# EAGLE schematic qsd67lc (EAGLE 9.2.1)

## Sheet 1 of 8: Supply
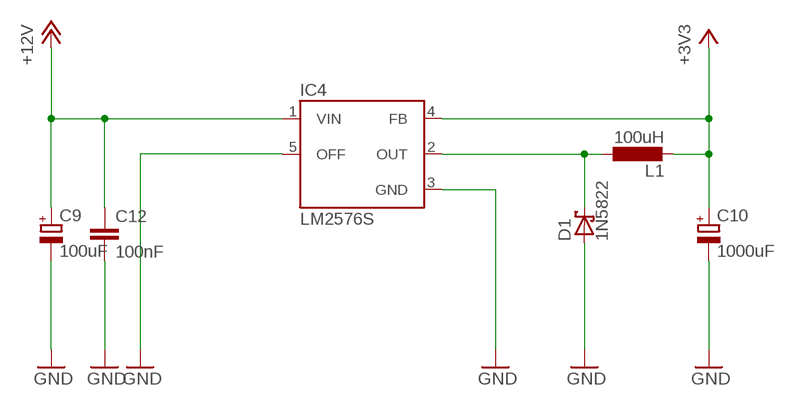
[diagram p0: schematic, sheet 1]

### Parts
C9  100uF  CPOL-EUE5-13  [E5-13]
C10  1000uF  CPOL-EUE5-10.5  [E5-10,5]
C12  100nF  C-EUC0805  [C0805]
D1  1N5822  SCHOTTKY-DIODEDO201T15  [DO201T15]
IC4  LM2576S  [TO263-5]
L1  100uH  L-EU2200-15.24  [2200-15.24]

### Nets
+3V3: C10.+ IC4.4(FB) L1.2 ; also sheet 2,3,5,6
+12V: C9.+ C12.1 IC4.1(VIN) ; also sheet 2,4,7
GND: C9.- C10.- C12.2 D1.A IC4.3(GND) IC4.5(OFF) ; also sheet 2,3,4,5,6,7
N$22: D1.C IC4.2(OUT) L1.1

## Sheet 2 of 8: atmega8
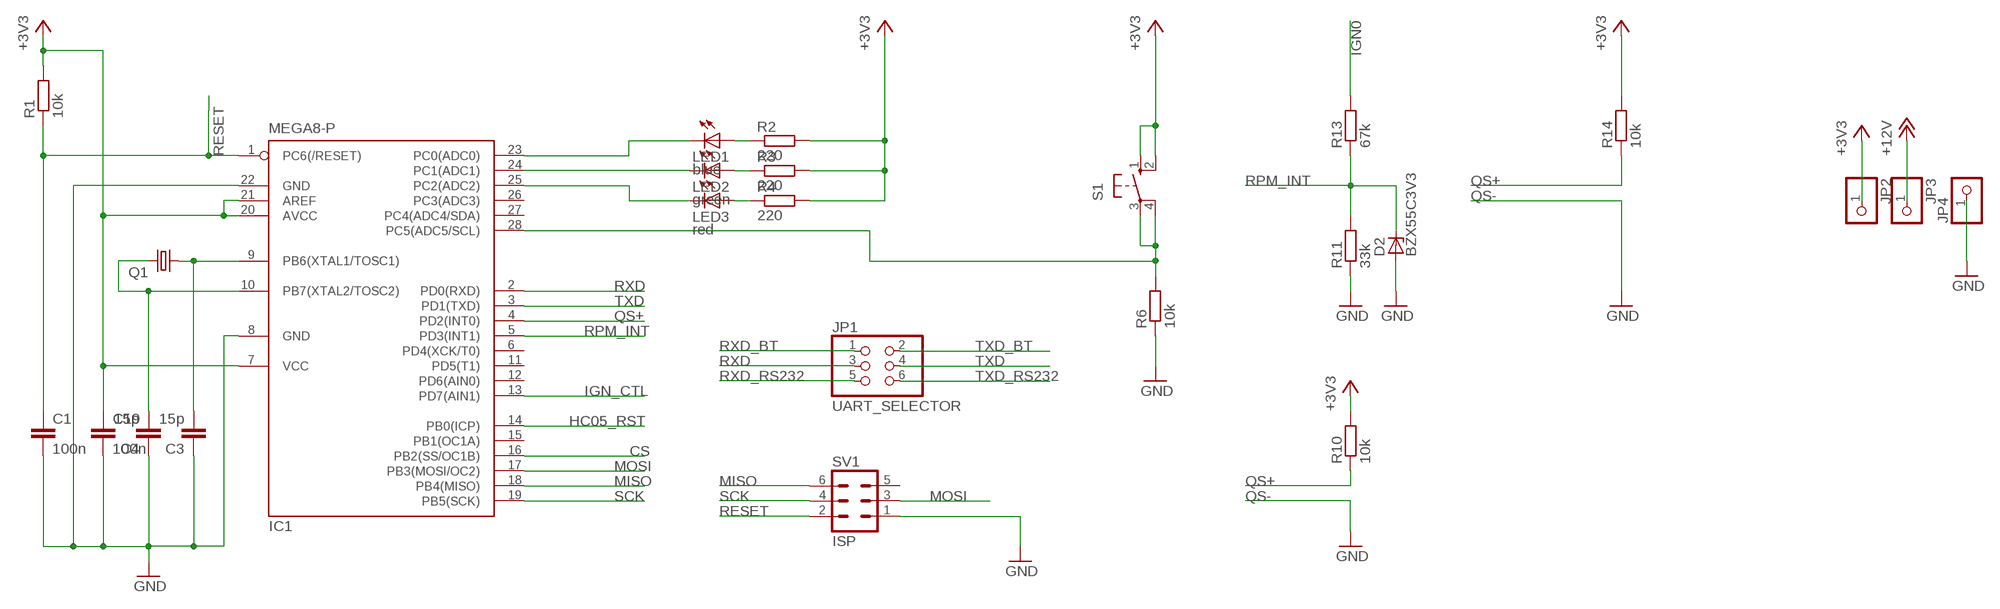
[diagram p1: schematic, sheet 2]

### Parts
C1  100n  C-EUC0805  [C0805]
C3  15p  C-EUC0805  [C0805]
C4  15p  C-EUC0805  [C0805]
C19  100n  C-EUC0805  [C0805]
D2  BZX55C3V3  BZX55  [DO35Z10]
IC1  MEGA8-P  [DIL28-3]
JP1  UART_SELECTOR  PINHD-2X3  [2X03]
JP2  PINHD-1X1  [1X01]
JP3  PINHD-1X1  [1X01]
JP4  PINHD-1X1  [1X01]
LED1  blue  LEDCHIP-LED0805  [CHIP-LED0805]
LED2  green  LEDCHIP-LED0805  [CHIP-LED0805]
LED3  red  LEDCHIP-LED0805  [CHIP-LED0805]
Q1  CRYSTALHC18U-V  [HC18U-V]
R1  10k  R-EU_R0805  [R0805]
R2  220  R-EU_R0805  [R0805]
R3  220  R-EU_R0805  [R0805]
R4  220  R-EU_R0805  [R0805]
R6  10k  R-EU_R0805  [R0805]
R10  10k  R-EU_R0805  [R0805]
R11  33k  R-EU_R0805  [R0805]
R13  67k  R-EU_R0805  [R0805]
R14  10k  R-EU_R0805  [R0805]
S1  10-XX  [B3F-10XX]
SV1  ISP  ML6  [ML6]

### Nets
+3V3: C19.1 IC1.7(VCC) IC1.20(AVCC) IC1.21(AREF) JP2.1 R1.2 R2.2 R3.2 R4.2 R10.2 R14.2 S1.1(S) S1.2(S1) ; also sheet 1,3,5,6
+12V: JP3.1 ; also sheet 1,4,7
CS: IC1.16(PB2(SS/OC1B))
GND: C1.2 C3.1 C4.1 C19.2 D2.A IC1.8(GND) IC1.22(GND) JP4.1 R6.1 R11.1 SV1.1 ; also sheet 1,3,4,5,6,7
HC05_RST: IC1.14(PB0(ICP)) ; also sheet 3
IGN0: R13.2 ; also sheet 7
IGN_CTL: IC1.13(PD7(AIN1)) ; also sheet 4
MISO: IC1.18(PB4(MISO)) SV1.6
MOSI: IC1.17(PB3(MOSI/OC2)) SV1.3
N$1: IC1.24(PC1(ADC1)) LED2.C
N$2: C3.2 IC1.9(PB6(XTAL1/TOSC1)) Q1.1
N$3: C4.2 IC1.10(PB7(XTAL2/TOSC2)) Q1.2
N$4: LED2.A R3.1
N$5: LED1.A R2.1
N$6: LED3.A R4.1
N$7: IC1.23(PC0(ADC0)) LED1.C
N$9: IC1.25(PC2(ADC2)) LED3.C
N$12: IC1.28(PC5(ADC5/SCL)) R6.2 S1.3(P) S1.4(P1)
QS+: IC1.4(PD2(INT0)) R10.1 R14.1 ; also sheet 7
RESET: C1.1 IC1.1(PC6(/RESET)) R1.1 SV1.2
RPM_INT: D2.C IC1.5(PD3(INT1)) R11.2 R13.1
RXD: IC1.2(PD0(RXD)) JP1.3
RXD_BT: JP1.1 ; also sheet 3
RXD_RS232: JP1.5 ; also sheet 5,6
SCK: IC1.19(PB5(SCK)) SV1.4
TXD: IC1.3(PD1(TXD)) JP1.4
TXD_BT: JP1.2 ; also sheet 3
TXD_RS232: JP1.6 ; also sheet 5,6
Unconnected: IC1.6(PD4(XCK/T0)) IC1.11(PD5(T1)) IC1.12(PD6(AIN0)) IC1.15(PB1(OC1A)) IC1.26(PC3(ADC3)) IC1.27(PC4(ADC4/SDA)) SV1.5

## Sheet 3 of 8: bluetooth
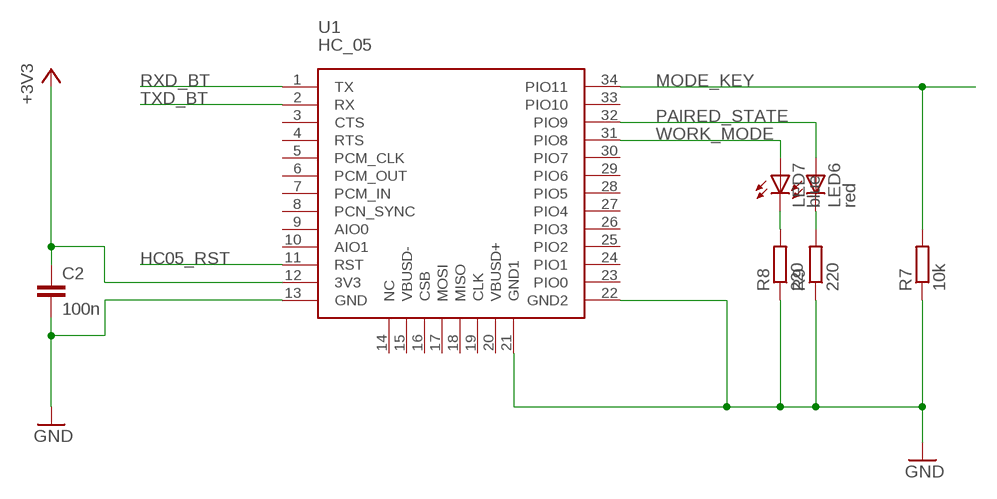
[diagram p2: schematic, sheet 3]

### Parts
C2  100n  C-EUC0805  [C0805]
LED6  red  LEDCHIP-LED0805  [CHIP-LED0805]
LED7  blue  LEDCHIP-LED0805  [CHIP-LED0805]
R7  10k  R-EU_R0805  [R0805]
R8  220  R-EU_R0805  [R0805]
R9  220  R-EU_R0805  [R0805]
U1  HC_05  [BLUETOOTH_SMD]

### Nets
+3V3: C2.1 U1.12(3V3) ; also sheet 1,2,5,6
GND: C2.2 R7.1 R8.1 R9.1 U1.13(GND) U1.21(GND1) U1.22(GND2) ; also sheet 1,2,4,5,6,7
HC05_RST: U1.11(RST) ; also sheet 2
MODE_KEY: R7.2 U1.34(PIO11)
N$13: LED7.C R8.2
N$14: LED6.C R9.2
PAIRED_STATE: LED6.A U1.32(PIO9)
RXD_BT: U1.1(TX) ; also sheet 2
TXD_BT: U1.2(RX) ; also sheet 2
WORK_MODE: LED7.A U1.31(PIO8)
Unconnected: U1.3(CTS) U1.4(RTS) U1.5(PCM_CLK) U1.6(PCM_OUT) U1.7(PCM_IN) U1.8(PCN_SYNC) U1.9(AIO0) U1.10(AIO1) U1.14(NC) U1.15(VBUSD-) U1.16(CSB) U1.17(MOSI) U1.18(MISO) U1.19(CLK) U1.20(VBUSD+) U1.23(PIO0) U1.24(PIO1) U1.25(PIO2) U1.26(PIO3) U1.27(PIO4) U1.28(PIO5) U1.29(PIO6) U1.30(PIO7) U1.33(PIO10)

## Sheet 4 of 8: ignition
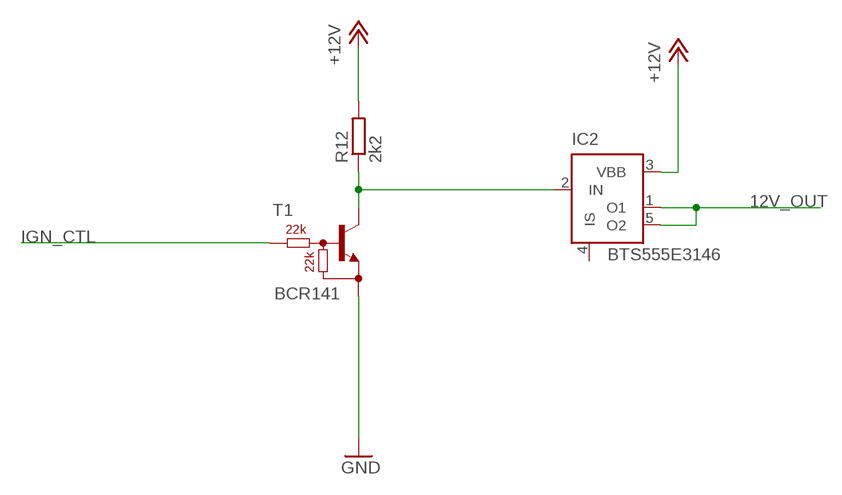
[diagram p3: schematic, sheet 4]

### Parts
IC2  BTS555E3146  [TO220-52]
R12  2k2  R-EU_R0805  [R0805]
T1  BCR141  [SOT23-R_INFINEON]

### Nets
12V_OUT: IC2.1(O1) IC2.5(O2) ; also sheet 7
+12V: IC2.3(VBB) R12.2 ; also sheet 1,2,7
GND: T1.2(E) ; also sheet 1,2,3,5,6,7
IGN_CTL: T1.1(B) ; also sheet 2
N$16: IC2.2(IN) R12.1 T1.3(C)
Unconnected: IC2.4(IS)

## Sheet 5 of 8: RS232
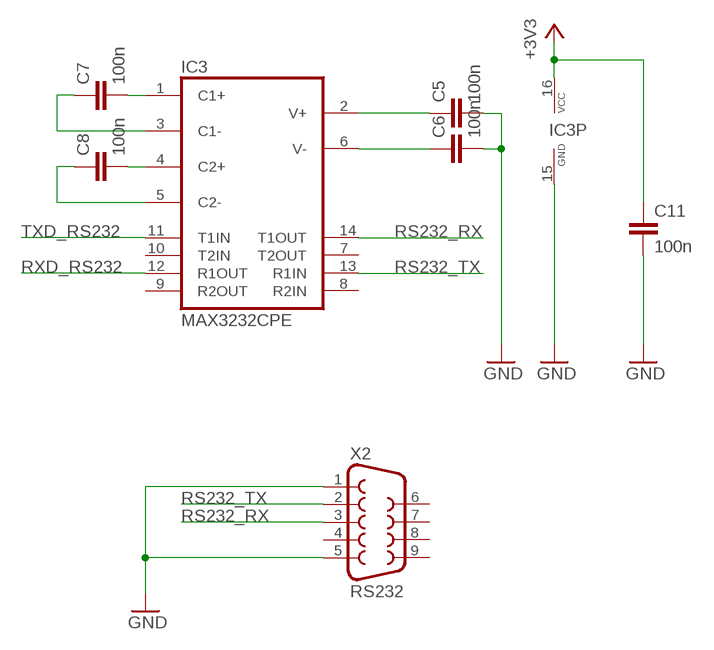
[diagram p4: schematic, sheet 5]

### Parts
C5  100n  C-EUC0805  [C0805]
C6  100n  C-EUC0805  [C0805]
C7  100n  C-EUC0805  [C0805]
C8  100n  C-EUC0805  [C0805]
C11  100n  C-EUC0805  [C0805]
IC3  MAX3232CPE  [DIL16]
X2  RS232  F09HP  [F09HP]

### Nets
+3V3: C11.1 IC3.16(VCC) ; also sheet 1,2,3,6
GND: C5.2 C6.2 C11.2 IC3.15(GND) X2.1 X2.5 ; also sheet 1,2,3,4,6,7
N$11: C5.1 IC3.2(V+)
N$15: C6.1 IC3.6(V-)
N$17: C7.2 IC3.1(C1+)
N$18: C8.2 IC3.4(C2+)
N$19: C8.1 IC3.5(C2-)
N$20: C7.1 IC3.3(C1-)
RS232_RX: IC3.14(T1OUT) X2.3
RS232_TX: IC3.13(R1IN) X2.2
RXD_RS232: IC3.12(R1OUT) ; also sheet 2,6
TXD_RS232: IC3.11(T1IN) ; also sheet 2,6
Unconnected: IC3.7(T2OUT) IC3.8(R2IN) IC3.9(R2OUT) IC3.10(T2IN) X2.4 X2.6 X2.7 X2.8 X2.9

## Sheet 6 of 8: USB FTDI
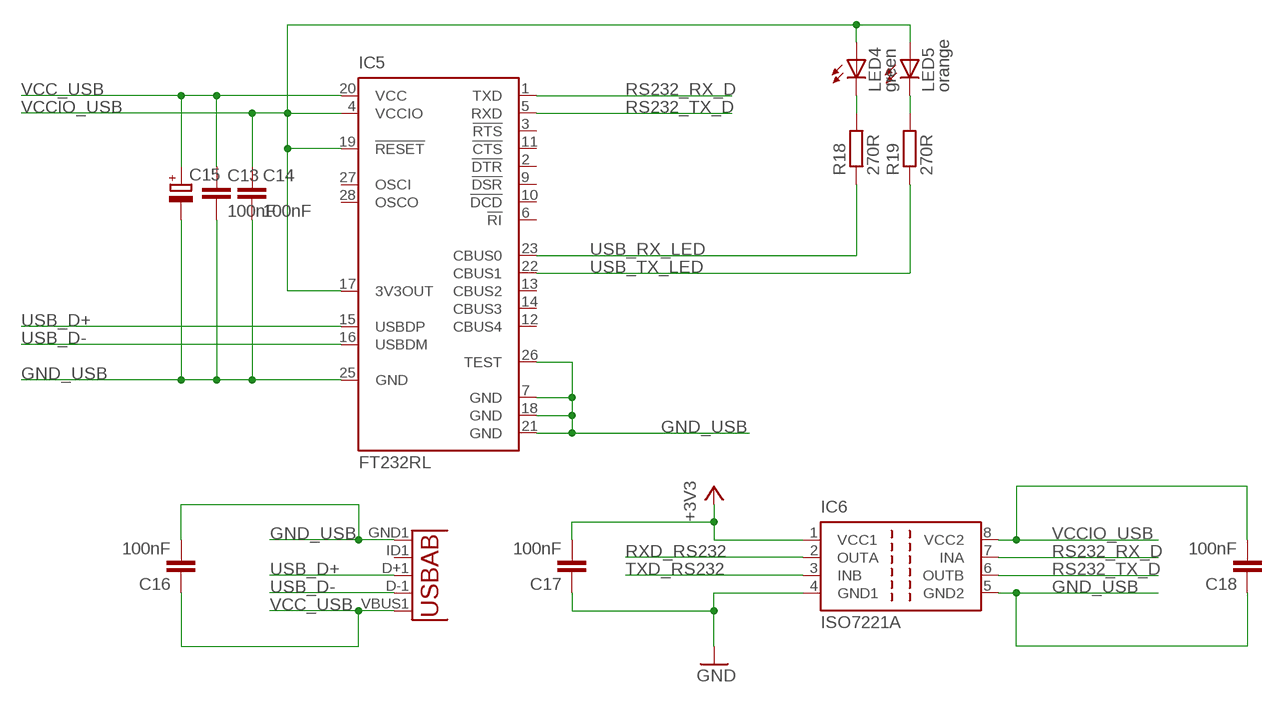
[diagram p5: schematic, sheet 6]

### Parts
C13  100nF  C-EUC0805  [C0805]
C14  100nF  C-EUC0805  [C0805]
C15  CPOL-EUE2.5-5  [E2,5-5]
C16  100nF  C-EUC0805  [C0805]
C17  100nF  C-EUC0805  [C0805]
C18  100nF  C-EUC0805  [C0805]
IC5  FT232RL  [SSOP28]
IC6  ISO7221A  [SO-08]
LED4  green  LEDSML0805  [SML0805]
LED5  orange  LEDSML0805  [SML0805]
R18  270R  R-EU_R0805  [R0805]
R19  270R  R-EU_R0805  [R0805]
U2  USB""  [USB-MICRO-SMD]

### Nets
+3V3: C17.2 IC6.1(VCC1) ; also sheet 1,2,3,5
GND: C17.1 IC6.4(GND1) ; also sheet 1,2,3,4,5,7
GND_USB: C13.2 C14.2 C15.- C16.2 C18.1 IC5.7(GND) IC5.18(GND) IC5.21(GND) IC5.25(GND) IC5.26(TEST) IC6.5(GND2) U2.GND1(GND)
N$23: LED4.C R18.2
N$26: LED5.C R19.2
RS232_RX_D: IC5.1(TXD) IC6.7(INA)
RS232_TX_D: IC5.5(RXD) IC6.6(OUTB)
RXD_RS232: IC6.2(OUTA) ; also sheet 2,5
TXD_RS232: IC6.3(INB) ; also sheet 2,5
USB_D+: IC5.15(USBDP) U2.D+1(D+)
USB_D-: IC5.16(USBDM) U2.D-1(D-)
USB_RX_LED: IC5.23(CBUS0) R18.1
USB_TX_LED: IC5.22(CBUS1) R19.1
VCC_USB: C13.1 C15.+ C16.1 IC5.20(VCC) U2.VBUS1(VBUS)
VCCIO_USB: C14.1 C18.2 IC5.4(VCCIO) IC5.17(3V3OUT) IC5.19(!RESET) IC6.8(VCC2) LED4.A LED5.A
Unconnected: IC5.2(!DTR) IC5.3(!RTS) IC5.6(!RI) IC5.9(!DSR) IC5.10(!DCD) IC5.11(!CTS) IC5.12(CBUS4) IC5.13(CBUS2) IC5.14(CBUS3) IC5.27(OSCI) IC5.28(OSCO) U2.ID1(USBID)

## Sheet 7 of 8: Connectors
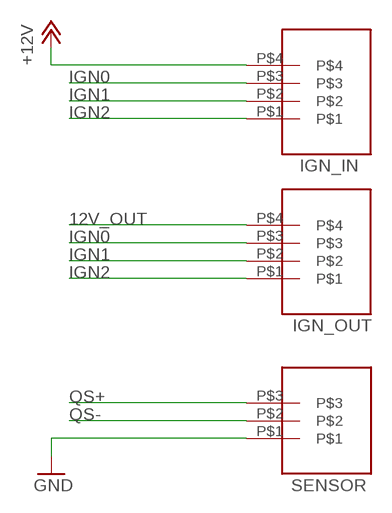
[diagram p6: schematic, sheet 7]

### Parts
CON1  RIA-AKL-230-04  [CON-RIA-P4]
CON2  RIA-AKL-230-04  [CON-RIA-P4]
CON3  RIA-AKL-230-03  [CON-RIA-P3]

### Nets
12V_OUT: CON2.P$4 ; also sheet 4
+12V: CON1.P$4 ; also sheet 1,2,4
GND: CON3.P$1 ; also sheet 1,2,3,4,5,6
IGN0: CON1.P$3 CON2.P$3 ; also sheet 2
IGN1: CON1.P$2 CON2.P$2
IGN2: CON1.P$1 CON2.P$1
QS+: CON3.P$3 ; also sheet 2
QS-: CON3.P$2 ; also sheet 2

### Notes on the sheet
- IGN_IN
- IGN_OUT
- SENSOR

## Sheet 8 of 8: holes
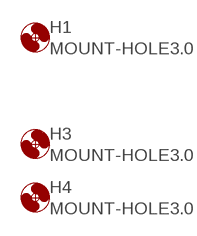
[diagram p7: schematic, sheet 8]

### Parts
H1  MOUNT-HOLE3.0  [3,0]
H3  MOUNT-HOLE3.0  [3,0]
H4  MOUNT-HOLE3.0  [3,0]

## Library data of the parts
C1-C8 C11-C14 C16-C19 = rcl:C-EU: CAPACITOR, European symbol; SPICEPREFIX: C
C9 C10 C15 = rcl:CPOL-EU: POLARIZED CAPACITOR, European symbol; SPICEPREFIX: C
CON1 CON2 = con-ria:RIA-AKL-230-04
CON3 = con-ria:RIA-AKL-230-03
D1 = diode:SCHOTTKY-DIODE: Schottky Diode
D2 = diode:BZX55: Z DIODE
H1 H3 H4 = holes:MOUNT-HOLE: MOUNTING HOLE with drill center marker
IC1 = atmel:MEGA8-P: MICROCONTROLLER 8 Kbytes FLASH, 1 kbytes SRAM, 512 bytes EEPROM, USART, 4-channel 10 bit ADC, 2-channel 8 bit ADC Pin compatible with Atmega48, ATMega88, ATMega168 Source: avr.lbr; OC_FARNELL: unknown; OC_NEWARK: unknown
IC2 = infineon:BTS555: PROFET® Data Sheet BTS555 Source: http://www.infineon.com/upload/Document/cmc_upload/documents/011/8726/Datasheet_BTS555.pdf; OC_FARNELL: unknown; OC_NEWARK: unknown
IC3 = maxim:MAX3232*: True RS-232 Transceivers 3.0V to 5.5V, Low-Power up to 1Mbps, Using Four 0.1µF External Capacitors Source: http://pdfserv.maxim-ic.com/en/ds/MAX3222-MAX3241.pdf; MF: MAXIM; MPN: MAX3232CPE+; OC_FARNELL: 9724494; OC_NEWARK: 68K4626
IC4 = v-reg-3:LM2576: National Semiconductor <http://www.national.com> 3.0A "Simple Switcher"(c) 52kHz, Vout 1.23-37V (HV: 57V), Vin 40V (HV: 60V), 50µA standby current
IC5 = ftdichip:FT232R: Source: http://www.ftdichip.com/Documents/DataSheets/DS_FT232R_v104.pdf; MPN: FT232RL; OC_FARNELL: 1146032; OC_NEWARK: 91K9918
IC6 = texas:ISO7221: DUAL DIGITAL ISOLATORS Source: http://focus.ti.com/lit/ds/symlink/iso7221a.pdf; MPN: ISO7221AD; OC_FARNELL: 1390651; OC_NEWARK: 48M0672
JP1 = pinhead:PINHD-2X3: PIN HEADER
JP2-JP4 = pinhead:PINHD-1X1: PIN HEADER
L1 = rcl:L-EU: INDUCTOR, European symbol; SPICEPREFIX: L
LED1-LED7 = led:LED: LED OSRAM: - CHIPLED LG R971, LG N971, LY N971, LG Q971, LY Q971, LO R971, LY R971 LH N974, LH R974 LS Q976, LO Q976, LY Q976 LO Q996 - Hyper CHIPLED LW Q18S LB Q993, LB Q99A, LB R99A - SideLED LS A670, LO A670, LY A670, LG A670, LP A670 LB A673, LV A673, LT A673, LW A673 LH A674 LY A675 LS A676, LA A676, LO A676, LY A676, LW A676 LS A679, LY A679, LG A679 - Hyper Micro SIDELED® LS Y876, LA Y876, LO Y876, LY Y876 LT Y87S - SmartLED LW L88C, LW L88S LB L89C, LB L89S, LG L890 LS L89K, LO L89K, LY L89K LS L896, LA L896, LO L896, LY L896 - TOPLED LS T670, LO T670, LY T670, LG T670, LP T670 LSG T670, LSP T670, LSY T670, LOP T670, LYG T670 LG T671, LOG T671, LSG T671 LB T673, LV T673, LT T673, LW T673 LH T674 LS T676, LA T676, LO T676, LY T676, LB T676, LH T676, LSB T676, LW T676 LB T67C, LV T67C, LT T67C, LS T67K, LO T67K, LY T67K, LW E67C LS E67B, LA E67B, LO E67B, LY E67B, LB E67C, LV E67C, LT E67C LW T67C LS T679, LY T679, LG T679 LS T770, LO T770, LY T770, LG T770, LP T770 LB T773, LV T773, LT T773, LW T773 LH T774 LS E675, LA E675, LY E675, LS T675 LS T776, LA T776, LO T776, LY T776, LB T776 LHGB T686 LT T68C, LB T68C - Hyper Mini TOPLED® LB M676 - Mini TOPLED Santana® LG M470 LS M47K, LO M47K, LY M47K Source: http://www.osram.convergy.de LUXEON: - LUMILED® LXK2-PW12-R00, LXK2-PW12-S00, LXK2-PW14-U00, LXK2-PW14-V00 LXK2-PM12-R00, LXK2-PM12-S00, LXK2-PM14-U00 LXK2-PE12-Q00, LXK2-PE12-R00, LXK2-PE12-S00, LXK2-PE14-T00, LXK2-PE14-U00 LXK2-PB12-K00, LXK2-PB12-L00, LXK2-PB12-M00, LXK2-PB14-N00, LXK2-PB14-P00, LXK2-PB14-Q00 LXK2-PR12-L00, LXK2-PR12-M00, LXK2-PR14-Q00, LXK2-PR14-R00 LXK2-PD12-Q00, LXK2-PD12-R00, LXK2-PD12-S00 LXK2-PH12-R00, LXK2-PH12-S00 LXK2-PL12-P00, LXK2-PL12-Q00, LXK2-PL12-R00 Source: www.luxeon.com KINGBRIGHT: KA-3528ASYC Source: www.kingbright.com
Q1 = crystal:CRYSTAL: CRYSTAL; OC_FARNELL: unknown; OC_NEWARK: unknown
R1-R4 R6-R14 R18 R19 = rcl:R-EU_: RESISTOR, European symbol; SPICEPREFIX: R
S1 = switch-omron:10-XX: OMRON SWITCH; MPN: B3F-1000; OC_FARNELL: 176432; OC_NEWARK: 36M3542
SV1 = con-harting-ml:ML6: HARTING; OC_FARNELL: unknown; OC_NEWARK: unknown
T1 = digital-transistors-2:BCR141: NPN Silicon Digital Transistor 50V 0,1A 0,2W
U1 = Bluetooth HC-05:HC_05: HC-05 Bluetooth Module
U2 = MicroUSB:USB: This is a USB AB connector that is compatible with USB OTG. i.e. this connector can serve as a host or device
X2 = con-subd:F09: SUB-D; OC_FARNELL: unknown; OC_NEWARK: unknown